# EAGLE design ADC5 (EAGLE 9.2.2)
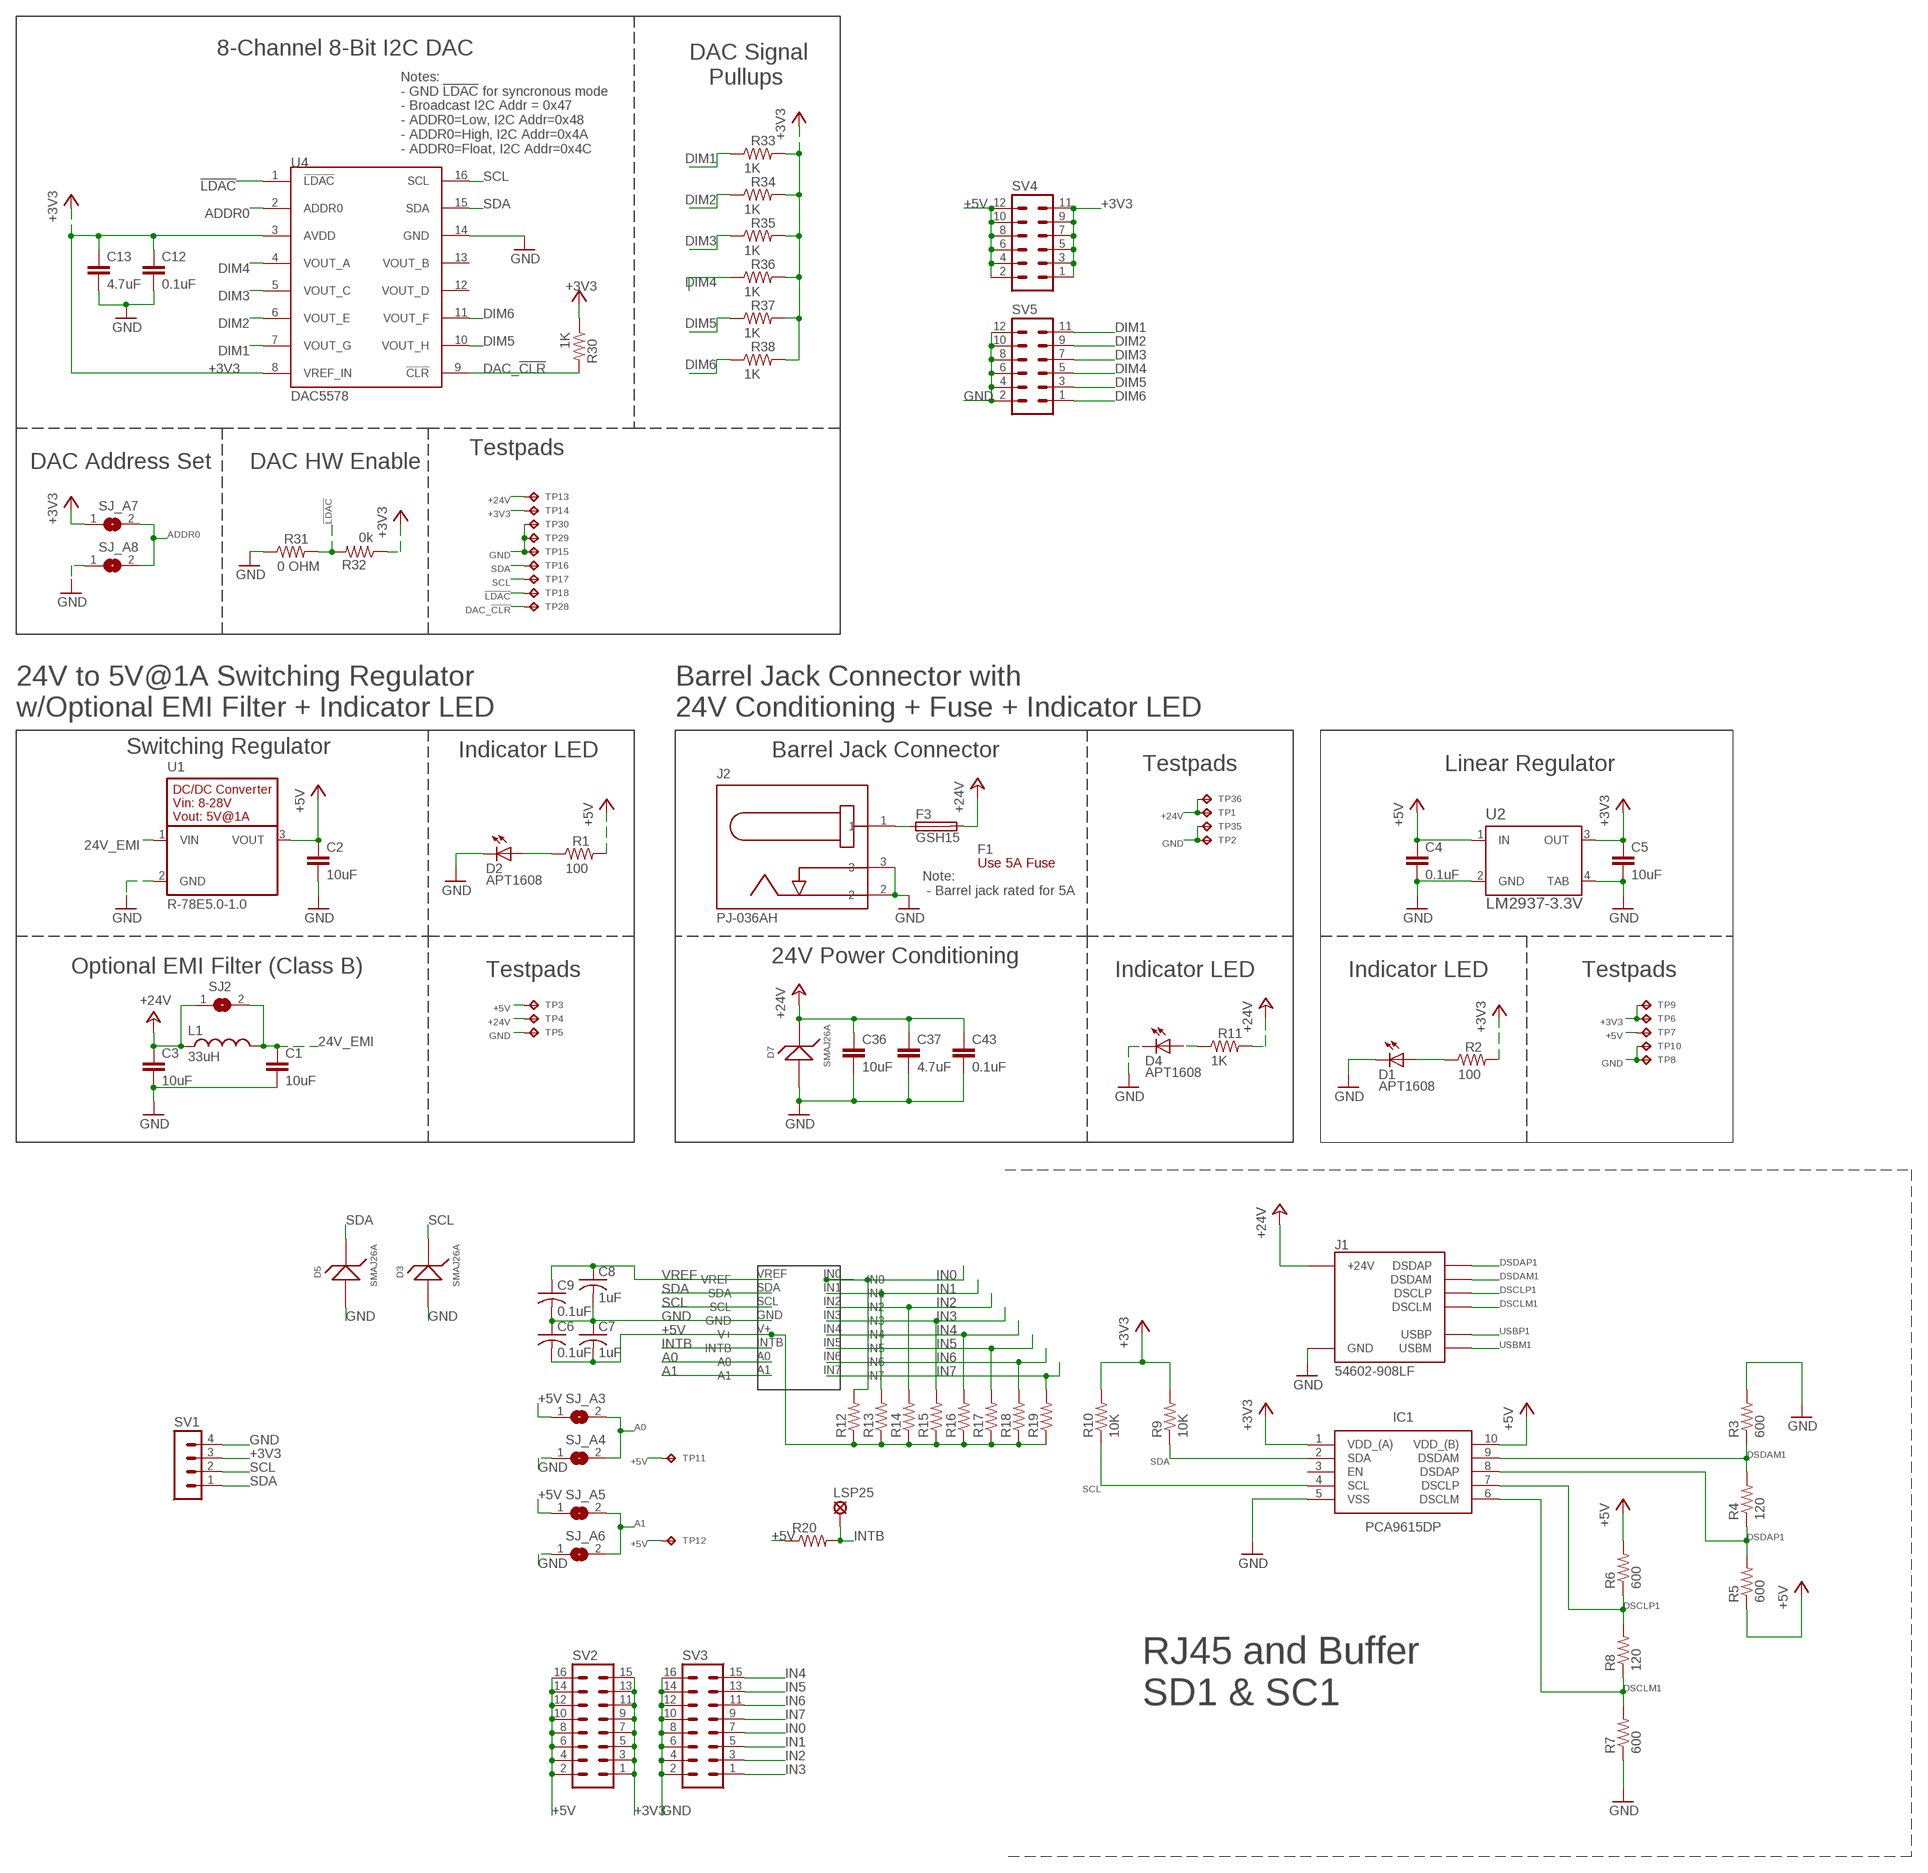
[diagram p0: schematic, sheet 1]

## Parts
C1  10uF  10UF-GMK212BBJ106KG-T  [C0805]
C2  10uF  10UF-GMK212BBJ106KG-T  [C0805]
C3  10uF  10UF-GMK212BBJ106KG-T  [C0805]
C4  0.1uF  0.1UF-C0603C104K5RACTU  [C0603]
C5  10uF  10UF-GMK212BBJ106KG-T  [C0805]
C6  0.1uF  C-USC0603  [C0603]
C7  1uF  C-USC0603  [C0603]
C8  1uF  C-USC0603  [C0603]
C9  0.1uF  C-USC0603  [C0603]
C12  0.1uF  0.1UF-C0603C104K5RACTU  [C0603]
C13  4.7uF  4.7UF-CL21A475KBQNNNE  [C0805]
C36  10uF  10UF-GMK212BBJ106KG-T  [C0805]
C37  4.7uF  4.7UF-CL21A475KBQNNNE  [C0805]
C43  0.1uF  0.1UF-C0603C104K5RACTU  [C0603]
D1  APT1608  APT1608CGCK  [CHIPLED_0603]
D2  APT1608  APT1608CGCK  [CHIPLED_0603]
D3  SMAJ26A  SMAJ26A-13-F  [SMA]
D4  APT1608  APT1608CGCK  [CHIPLED_0603]
D5  SMAJ26A  SMAJ26A-13-F  [SMA]
D7  SMAJ26A  SMAJ26A-13-F  [SMA]
F1  Use 5A Fuse  0217005.MXP  [FUSE-CARTRIDGE]
F3  GSH15  [GSH15]
IC1  PCA9615DP  [SOP50P490X110-10N]
J1  54602-908LF  OPENAG-V1-RJ45PTH  [OPENAG-V1-RJ45]
J2  PJ-036AH  BARREL-JACK-PJ-036AH-SMT-TR  [BARREL-JACK-PJ-036AH]
L1  33uH  33UH-29333C  [29333C]
LSP25  LSP10  [LSP10]
R1  100  100OHM-RC0603JR-07100RL  [RC0603N]
R2  100  100OHM-RC0603JR-07100RL  [RC0603N]
R3  600  R-US_R0603  [R0603]
R4  120  R-US_R0603  [R0603]
R5  600  R-US_R0603  [R0603]
R6  600  R-US_R0603  [R0603]
R7  600  R-US_R0603  [R0603]
R8  120  R-US_R0603  [R0603]
R9  10K  R-US_R0603  [R0603]
R10  10K  R-US_R0603  [R0603]
R11  1K  1K-ERJ-PB3D1001V  [RC0603N]
R12  R-US_R0603  [R0603]
R13  R-US_R0603  [R0603]
R14  R-US_R0603  [R0603]
R15  R-US_R0603  [R0603]
R16  R-US_R0603  [R0603]
R17  R-US_R0603  [R0603]
R18  R-US_R0603  [R0603]
R19  R-US_R0603  [R0603]
R20  R-US_R0603  [R0603]
R30  1K  1K-ERJ-PB3D1001V  [RC0603N]
R31  0 OHM  0OHM-RC0603JR-070RL  [RC0603N]
R32  0k  1K-ERJ-PB3D1001V  [RC0603N]
R33  1K  1K-ERJ-PB3D1001V  [RC0603N]
R34  1K  1K-ERJ-PB3D1001V  [RC0603N]
R35  1K  1K-ERJ-PB3D1001V  [RC0603N]
R36  1K  1K-ERJ-PB3D1001V  [RC0603N]
R37  1K  1K-ERJ-PB3D1001V  [RC0603N]
R38  1K  1K-ERJ-PB3D1001V  [RC0603N]
SJ2  EMI-BYPASS  [EMI-BYPASS]
SJ_A3  SOLDERJUMPERREFLOW_NOPASTE  [SJ1]
SJ_A4  SOLDERJUMPERREFLOW_NOPASTE  [SJ1]
SJ_A5  SOLDERJUMPERREFLOW_NOPASTE  [SJ1]
SJ_A6  SOLDERJUMPERREFLOW_NOPASTE  [SJ1]
SJ_A7  SOLDERJUMPERREFLOW_NOPASTE  [SJ1]
SJ_A8  SOLDERJUMPERREFLOW_NOPASTE  [SJ1]
SV1  MA04-1  [MA04-1]
SV2  MA08-2  [MA08-2]
SV3  MA08-2  [MA08-2]
SV4  MA06-2  [MA06-2]
SV5  MA06-2  [MA06-2]
TP1  TPTP04R  [TP04R]
TP2  TPTP04R  [TP04R]
TP3  TPTP06R  [TP06R]
TP4  TPTP06R  [TP06R]
TP5  TPTP06R  [TP06R]
TP6  TPTP04R  [TP04R]
TP7  TPTP04R  [TP04R]
TP8  TPTP04R  [TP04R]
TP9  TPTP04R  [TP04R]
TP10  TPTP04R  [TP04R]
TP11  TPTP04R  [TP04R]
TP12  TPTP04R  [TP04R]
TP13  TPTP04R  [TP04R]
TP14  TPTP04R  [TP04R]
TP15  TPTP04R  [TP04R]
TP16  TPTP04R  [TP04R]
TP17  TPTP04R  [TP04R]
TP18  TPTP04R  [TP04R]
TP28  TPTP04R  [TP04R]
TP29  TPTP04R  [TP04R]
TP30  TPTP04R  [TP04R]
TP35  TPTP04R  [TP04R]
TP36  TPTP04R  [TP04R]
U1  R-78E5.0-1.0  [R-78E5.0-1.0]
U2  LM2937-3.3V  LM2937IMP-3.3/NOPB  [MP04A]
U4  DAC5578  DAC5578SPW  [TSSOP16]
U$1  ADC128D818  [TSSOP16]

## Nets
24V_EMI: C1.1 L1.2 SJ2.2 U1.1(VIN)
24V_IN: F3.1 J2.1
!LDAC!: R31.2 R32.2 TP18.1(TP) U4.1(!LDAC!)
+3V3: C5.1 C12.1 C13.1 IC1.1(VDD_(A)) R2.2 R9.2 R10.2 R30.1 R32.1 R33.2 R34.2 R35.2 R36.2 R37.2 R38.2 SJ_A7.1 SV1.3 SV2.1 SV2.3 SV2.5 SV2.7 SV2.9 SV2.11 SV2.13 SV2.15 SV4.1 SV4.3 SV4.5 SV4.7 SV4.9 SV4.11 TP6.1(TP) TP9.1(TP) TP14.1(TP) U2.3(OUT) U4.3(AVDD) U4.8(VREF_IN)
+5V: C2.1 C4.1 C6.2 C7.2 IC1.10(VDD_(B)) R1.2 R5.1 R6.2 R12.1 R13.1 R14.1 R15.1 R16.1 R17.1 R18.1 R19.1 R20.1 SJ_A3.1 SJ_A5.1 SV2.2 SV2.4 SV2.6 SV2.8 SV2.10 SV2.12 SV2.14 SV2.16 SV4.2 SV4.4 SV4.6 SV4.8 SV4.10 SV4.12 TP3.TP TP7.1(TP) TP11.1(TP) TP12.1(TP) U1.3(VOUT) U2.1(IN) U$1.V+
+24V: C3.1 C36.1 C37.1 C43.1 D7.1 F3.2 J1.24V(6)(+24V) L1.1 R11.2 SJ2.1 TP1.1(TP) TP4.TP TP13.1(TP) TP36.1(TP)
A0: SJ_A3.2 SJ_A4.2 U$1.A0
A1: SJ_A5.2 SJ_A6.2 U$1.A1
ADDR0: SJ_A7.2 SJ_A8.2 U4.2(ADDR0)
DAC_!CLR!: R30.2 TP28.1(TP) U4.9(!CLR!)
DIM1: R33.1 SV5.11 U4.7(VOUT_G)
DIM2: R34.1 SV5.9 U4.6(VOUT_E)
DIM3: R35.1 SV5.7 U4.5(VOUT_C)
DIM4: R36.1 SV5.5 U4.4(VOUT_A)
DIM5: R37.1 SV5.3 U4.10(VOUT_H)
DIM6: R38.1 SV5.1 U4.11(VOUT_F)
DSCLM1: IC1.6(DSCLM) J1.DSCLM(5)(DSCLM) R7.2 R8.1
DSCLP1: IC1.7(DSCLP) J1.DSCLP(4)(DSCLP) R6.1 R8.2
DSDAM1: IC1.9(DSDAM) J1.DSDAM(2)(DSDAM) R3.1 R4.2
DSDAP1: IC1.8(DSDAP) J1.DSDAP(1)(DSDAP) R4.1 R5.2
GND: C1.2 C2.2 C3.2 C4.2 C5.2 C6.1 C7.1 C8.2 C9.2 C12.2 C13.2 C36.2 C37.2 C43.2 D1.C D2.C D3.2 D4.C D5.2 D7.2 IC1.5(VSS) J1.GND(3)(GND) J2.2 J2.3 R3.2 R7.1 R31.1 SJ_A4.1 SJ_A6.1 SJ_A8.1 SV1.4 SV3.2 SV3.4 SV3.6 SV3.8 SV3.10 SV3.12 SV3.14 SV3.16 SV5.2 SV5.4 SV5.6 SV5.8 SV5.10 SV5.12 TP2.1(TP) TP5.TP TP8.1(TP) TP10.1(TP) TP15.1(TP) TP29.1(TP) TP30.1(TP) TP35.1(TP) U1.2(GND) U2.2(GND) U2.4(TAB) U4.14(GND) U$1.GND
IN0: R12.2 SV3.7 U$1.IN0
IN1: R13.2 SV3.5 U$1.IN1
IN2: R14.2 SV3.3 U$1.IN2
IN3: R15.2 SV3.1 U$1.IN3
IN4: R16.2 SV3.15 U$1.IN4
IN5: R17.2 SV3.13 U$1.IN5
IN6: R18.2 SV3.11 U$1.IN6
IN7: R19.2 SV3.9 U$1.IN7
INTB: LSP25.MP R20.2 U$1.INTB
N$1: D1.A R2.1
N$2: D2.A R1.1
N$4: D4.A R11.1
SCL: D3.1 IC1.4(SCL) R10.1 SV1.2 TP17.1(TP) U4.16(SCL) U$1.SCL
SDA: D5.1 IC1.2(SDA) R9.1 SV1.1 TP16.1(TP) U4.15(SDA) U$1.SDA
USBM1: J1.USBM(8)(USBM)
USBP1: J1.USBP(7)(USBP)
VREF: C8.1 C9.1 U$1.VREF
Unconnected: IC1.3(EN) U4.12(VOUT_D) U4.13(VOUT_B)

## Notes on the sheet
- 8-Channel 8-Bit I2C DAC
- DAC Signal 
     Pullups
- Notes:
  - GND !LDAC! for syncronous mode
  - Broadcast I2C Addr = 0x47
  - ADDR0=Low, I2C Addr=0x48
  - ADDR0=High, I2C Addr=0x4A
  - ADDR0=Float, I2C Addr=0x4C
- Testpads
- DAC Address Set | DAC HW Enable
- 24V to 5V@1A Switching Regulator
  w/Optional EMI Filter + Indicator LED
- Barrel Jack Connector with
  24V Conditioning + Fuse + Indicator LED
- Switching Regulator | Indicator LED | Barrel Jack Connector
- Testpads | Linear Regulator
- Note:
   - Barrel jack rated for 5A
- 24V Power Conditioning
- Optional EMI Filter (Class B) | Testpads | Indicator LED | Indicator LED | Testpads
- RJ45 and Buffer
  SD1 & SC1

## Library data of the parts
C1-C3 C5 C36 = openag-capacitors:10UF-GMK212BBJ106KG-T: CAP CER 10UF 35V X5R 0805 Description: 10µF ±10% 35V Ceramic Capacitor X5R 0805 (2012 Metric) Technical Specifications: Capacitance: 10µF Tolerance: ±10% Rated Voltage: 35V Temperature Coefficient: X5R Operating Temperature: -55°C ~ 85°C Package / Case: 0805 (2012 Metric) Datasheet(s): GMK212BBJ106KG-T Spec <http://ds.yuden.co.jp/TYCOMPAS/ut/detail.do?productNo=GMK212BBJ106KG-T&fileName=GMK212BBJ106KG-T_SS&mode=specSheetDownload> Vendor(s): Digikey: 587-4893-1-ND <https://www.digikey.com/product-detail/en/taiyo-yuden/GMK212BBJ106KG-T/587-4893-1-ND/6563736>; MANUFACTURER: Taiyo Yuden; MPN: GMK212BBJ106KG-T; VENDOR: Digikey; VLINK: https://www.digikey.com/product-detail/en/taiyo-yuden/GMK212BBJ106KG-T/587-4893-1-ND/6563736; VPN: 587-4893-1-ND
C4 C12 C43 = openag-capacitors:0.1UF-C0603C104K5RACTU: CAP CER 0.1UF 50V X7R 0603 Description: 0.1µF ±10% 50V Ceramic Capacitor X7R 0603 (1608 Metric) Technical Specifications: Capacitance: 0.1µF Tolerance: ±10% Rated Voltage: 50V Temperature Coefficient: X7R Operating Temperature: -55°C ~ 125°C Package / Case: 0603 (1608 Metric) Datasheet(s): X7R Dielectric, 6.3-250 VDC <https://search.kemet.com/component-edge/download/datasheet/C0603C104K5RACTU.pdf> Vendor(s): Digikey: 399-5089-1-ND <https://www.digikey.com/product-detail/en/kemet/C0603C104K5RACTU/399-5089-1-ND/1465623>; MANUFACTURER: Kemet; MPN: C0603C104K5RACTU; VENDOR: Digikey; VLINK: https://www.digikey.com/product-detail/en/kemet/C0603C104K5RACTU/399-5089-1-ND/1465623; VPN: 399-5089-1-ND
C6-C9 = rcl:C-US: CAPACITOR, American symbol; SPICEPREFIX: C
C13 C37 = openag-capacitors:4.7UF-CL21A475KBQNNNE: CAP CER 4.7UF 50V X5R 0805 Description: 4.7µF ±10% 50V Ceramic Capacitor X5R 0805 (2012 Metric) Technical Specifications: Capacitance: 4.7uF Tolerance: ±10% Rated Voltage: 50V Temperature Coefficient: X5R Operating Temperature: -55°C ~ 85°C Package/Case: 0805 (2012 Metric) Datasheet(s): CL21A475KBQNNNE Characteristics <http://www.samsungsem.com/kr/front/downloadcms.do?path=/kr/support/product-search/mlcc/__icsFiles/afieldfile/2014/11/05&fileName=C_CL21A475KBQNNNE.pdf> Vendor(s): Digikey: 1276-1248-1-ND <https://www.digikey.com/product-detail/en/samsung-electro-mechanics/CL21A475KBQNNNE/1276-1248-1-ND/3889334>; MANUFACTURER: Samsung; MPN: CL21A475KBQNNNE; VENDOR: Digikey; VLINK: https://www.digikey.com/product-detail/en/samsung-electro-mechanics/CL21A475KBQNNNE/1276-1248-1-ND/3889334; VPN: 1276-1248-1-ND
D1 D2 D4 = openag-diodes:APT1608CGCK: LED GREEN CLEAR 0603 SMD Description: Green 570nm LED Indication - Discrete 2.1V 0603 (1608 Metric) Technical Specifications: Color: Green Lens Color: Colorless Lens Transparency: Clear Millicandela Rating: 50mcd Lens Style/Size: Rectangle with Flat Top, 1.20mm x 0.80mm Voltage - Forward (Vf) (Typ): 2.1V Current - Test: 20mA Viewing Angle: 120° Mounting Type: Surface Mount Wavelength - Dominant: 570nm Wavelength - Peak: 574nm Package / Case: 0603 (1608 Metric) Supplier Device Package: Chip LED Size / Dimension: 1.60mm L x 0.80mm W Height (Max): 0.75mm Datasheet(s): APT1608CGCK <http://www.kingbrightusa.com/images/catalog/SPEC/APT1608CGCK.pdf> Vendor(s): Digikey: 754-1116-1-ND <https://www.digikey.com/product-detail/en/kingbright/APT1608CGCK/754-1116-1-ND/1747833#>; MANUFACTURER: Kingbright; MPN: APT1608CGCK; VENDOR: Digikey; VLINK: https://www.digikey.com/product-detail/en/kingbright/APT1608CGCK/754-1116-1-ND/1747833#; VPN: 754-1116-1-ND
D3 D5 D7 = openag-diodes:SMAJ26A-13-F: TVS DIODE 26VWM 42.1VC SMA Description: TVS DIODE 26VWM 42.1VC SMA Technical Specifications: Type: Zener Voltage - Reverse Standoff (Typ): 26V Voltage - Breakdown (Min): 28.9V Voltage - Clamping (Max) @ Ipp: 42.1V Current - Peak Pulse (10/1000µs): 9.5A Power - Peak Pulse: 400W Power Line Protection: No Operating Temperature: -55°C ~ 150°C (TJ) DO-214AC, SMA Datasheet(s): SMAJ5.0(C)A - SMAJ200(C)A Vendor(s): Digikey: SMAJ26A-FDICT-ND <https://www.digikey.com/product-detail/en/diodes-incorporated/SMAJ26A-13-F/SMAJ26A-FDICT-ND/806583>; MANUFACTURER: Diodes Incorporated; MPN: SMAJ26A-13-F; VENDOR: Digikey; VLINK: https://www.digikey.com/product-detail/en/diodes-incorporated/SMAJ26A-13-F/SMAJ26A-FDICT-ND/806583; VPN: SMAJ26A-FDICT-ND
F1 = openag-fuses:0217005.MXP: FUSE GLASS 5A 250VAC 5X20MM Description: FUSE GLASS 5A 250VAC 5X20MM Technical Specifications: Fuse Type: Cartridge, Glass Current Rating: 5A Voltage Rating - AC: 250V Response Time: Fast Package / Case: 5mm x 20mm Mounting Type: Holder Breaking Capacity @ Rated Voltage: 50A Melting I²t: 42.795 Approvals: BSI, CE, CCC, CSA, KC, PSE, SEMKO, UR, VDE Operating Temperature: -55°C ~ 125°C Size / Dimension: 0.205" Dia x 0.787" L (5.20mm x 20.00mm) DC Cold Resistance: 0.0137 Ohms Datasheet(s): 217 Series Datasheet <http://www.littelfuse.com/~/media/electronics/datasheets/fuses/littelfuse_fuse_217_datasheet.pdf.pdf> Vendor(s): Digikey: F1725-ND <https://www.digikey.com/product-detail/en/littelfuse-inc/0217005.MXP/F1725-ND/777549#>; MANUFACTURER: Littelfuse Inc.; MPN: 0217005.MXP; VENDOR: Digikey; VLINK: https://www.digikey.com/product-detail/en/littelfuse-inc/0217005.MXP/F1725-ND/777549; VPN: F1725-ND
F3 = openag-fuses:GSH15: FUSE BLOCK CART 250V 6.3A PCB Description: Fuse Block 6.3A 250V 1 Circuit Cartridge PCB Technical Specifications: Fuseholder Type: Block Fuse Type: Cartridge For Use With/Related Products: 5mm x 20mm Fuse Size: 5mm x 20mm Number of Circuits: 1 Voltage: 250V Current Rating: 6.3A Mounting Type: PCB Orientation: Horizontal Termination Style: PC Pin Contact Material: Copper Alloy Contact Finish: Tin Datasheet(s): 649 Series <http://www.littelfuse.com/~/media/electronics/datasheets/fuse_blocks/littelfuse_fuse_block_649_datasheet.pdf.pdf> Vendor(s): Digikey: WK0011-ND <https://www.digikey.com/product-detail/en/littelfuse-inc/64900001039/WK0011-ND/245470>; MANUFACTURER: Littelfuse Inc.; MPN: 64900001039; VENDOR: Digikey; VLINK: https://www.digikey.com/product-detail/en/littelfuse-inc/64900001039/WK0011-ND/245470; VPN: WK0011-ND
IC1 = PCA9615DP:PCA9615DP: Buffer, ReDriver 2 Channel 400kHz 10-TSSOP Source: Datasheet <http://www.nxp.com/docs/en/data-sheet/PCA9615.pdf>; DESCRIPTION: Buffer, ReDriver 2 Channel 400kHz 10-TSSOP; HEIGHT: 1.1mm; MANUFACTURER_NAME: Nexperia; MANUFACTURER_PART_NUMBER: PCA9615DP; SUPPLIER_NAME: RS
J1 = openag_connector:OPENAG-V1-RJ45: Amphenol FCI - 54602-908LF - CONN MOD JACK 8P8C R/A UNSHLD Description: Jack Modular Connector 8p8c (RJ45, Ethernet) 90� Angle (Right) Unshielded Cat3 Technical Specifications: Connector Type: Jack Number of Positions/Contacts: 8p8c (RJ45, Ethernet) Number of Ports: 1 Number of Rows: 1 Mounting Type: Through Hole Orientation: 90� Angle (Right) Termination: Solder Shielding: Unshielded Ratings: Cat3 Features: Board Lock LED Color: Does Not Contain LED Tab Direction: Down Contact Material: Copper Alloy Contact Finish: Gold Contact Finish Thickness: 15�in (0.38�m) Housing Material: Polyester, Glass Filled Operating Temperature: -40�C ~ 70�C Datasheet(s): 54601-x04(zzz)WPLF Drawing <http://cdn.amphenol-icc.com/media/wysiwyg/files/drawing/c-bmj-0102.pdf> Vendor(s): Digikey: 609-1046-ND <https://www.digikey.com/product-detail/en/amphenol-fci/54602-908LF/609-1046-ND/1001360>; POPULATE: YES; VERIFIED: NO
J2 = openag-connectors:BARREL-JACK-PJ-036AH-SMT-TR: CONN PWR JACK 2X5.5MM SOLDER Description: Power Barrel Connector Jack 2.10mm ID (0.083"), 5.50mm OD (0.217") Surface Mount, Right Angle Technical Specifications: Connector Type: Jack Gender: Male Industry Recognized Mating Diameter: 2.10mm ID (0.083"), 5.50mm OD (0.217") Actual Diameter: 0.078" (2.00mm ID), 0.248" (6.30mm OD) Number of Positions/Contacts: 2 Conductors, 3 Contacts Internal Switch(s): Single Switch, Normally Closed Mounting Type: Surface Mount, Right Angle Termination: Solder Shielding: Unshielded Voltage - Rated: 24VDC Current Rating: 5A Mating Length/Depth: 0.360" (9.15mm) Contact Material - Plating: Silver Operating Temperature: -25°C ~ 85°C Housing Material: Polyamide (PA6T), Nylon 6T Contact Material: Brass; Copper Alloy Body Color: Black Datasheet(s): PJ-036AH-SMT-TR <http://www.cui.com/product/resource/digikeypdf/pj-036ah-smt-tr.pdf> Vendor(s): Digikey: CP-036AHPJCT-ND <https://www.digikey.com/product-detail/en/cui-inc/PJ-036AH-SMT-TR/CP-036AHPJCT-ND/1530994>; MANUFACTURER: CUI Inc.; MPN: PJ-036AH-SMT-TR; VENDOR: Digikey; VLINK: https://www.digikey.com/product-detail/en/cui-inc/PJ-036AH-SMT-TR/CP-036AHPJCT-ND/1530994; VPN: CP-036AHPJCT-ND
L1 = openag-inductors:33UH-29333C: FIXED IND 33UH 1A 120 MOHM SMD Description: 33µH Shielded Wirewound Inductor 1A 120 mOhm Max Nonstandard Technical Specifications: Type: Wirewound Inductance: 33µH Current Rating: 1A Shielding: Shielded DC Resistance (DCR): 120 mOhm Max Operating Temperature: -40°C ~ 85°C Frequency - Test: 10kHz Mounting Type: Surface Mount Package / Case: Nonstandard Size / Dimension: 0.283" L x 0.283" W (7.20mm x 7.20mm) Height - Seated (Max): 0.157" (4.00mm) Datasheet(s): 2900 Series <https://www.murata-ps.com/data/magnetics/kmp_2900.pdf> Vendor(s): Digikey: 811-1138-1-ND <https://www.digikey.com/product-detail/en/murata-power-solutions-inc/29333C/811-1138-1-ND/1924860>; MANUFACTURER: Murata Power Solutions Inc.; MPN: 29333C; VENDOR: Digikey; VLINK: https://www.digikey.com/product-detail/en/murata-power-solutions-inc/29333C/811-1138-1-ND/1924860; VPN: 811-1138-1-ND
LSP25 = solpad:LSP10: SOLDER PAD drill 1.0 mm, distributor Buerklin, 12H555
R1 R2 = openag-resistors:100OHM-RC0603JR-07100RL: RES SMD 100 OHM 5% 1/10W 0603 Description: 100 Ohms ±5% 0.1W, 1/10W Chip Resistor 0603 (1608 Metric) Moisture Resistant Thick Film Technical Specifications: Resistance: 100 Ohms Tolerance: ±5% Power (Watts): 0.1W, 1/10W Composition: Thick Film Features: Moisture Resistant Temperature Coefficient: ±100ppm/°C Operating Temperature: -55°C ~ 155°C Package / Case: 0603 (1608 Metric) Supplier Device Package: 0603 Size / Dimension: 0.063" L x 0.032" W (1.60mm x 0.80mm) Height - Seated (Max): 0.022" (0.55mm) Number of Terminations: 2 Datasheet(s): Thick Film Chip Resistor Intro <http://www.yageo.com.tw/exep/pages/download/literatures/PYu-R_INT-thick_7.pdf> Chip Resistor Marking <http://www.yageo.com/exep/pages/download/literatures/PYu-R_Marking_2.pdf> RC Series, L Datasheet <http://www.yageo.com/documents/recent/PYu-RC_Group_51_RoHS_L_8.pdf> Vendor(s): Digikey: 311-100GRCT-ND <https://www.digikey.com/product-detail/en/yageo/RC0603JR-07100RL/311-100GRCT-ND/729644>; MANUFACTURER: Yageo; MPN: RC0603JR-07100RL; VENDOR: Digikey; VLINK: https://www.digikey.com/product-detail/en/yageo/RC0603JR-07100RL/311-100GRCT-ND/729644; VPN: 311-100GRCT-ND
R3-R10 R12-R19 = rcl:R-US_: RESISTOR, American symbol; SPICEPREFIX: R
R11 R30 R33-R38 = openag-resistors:1K-ERJ-PB3D1001V: RES SMD 1K OHM 0.5% 1/5W 0603 Description: 1 kOhms ±0.5% 0.2W, 1/5W Chip Resistor 0603 (1608 Metric) Automotive AEC-Q200, Pulse Withstanding Thick Film Technical Specifications: Resistance: 1 kOhms Tolerance: ±0.5% Power: 0.2W, 1/5W Operating Temperature: -55°C ~ 155°C Package / Case: 0603 (1608 Metric) Datasheet(s): ERJ-PB3, PB6 Series, High Precision Datasheet <https://industrial.panasonic.com/cdbs/www-data/pdf/RDM0000/AOA0000C328.pdf> Vendor(s): Digikey: P20283CT-ND <https://www.digikey.com/product-detail/en/panasonic-electronic-components/ERJ-PB3D1001V/P20283CT-ND/6214538>; MANUFACTURER: Panasonic; MPN: P20283CT-ND; VENDOR: Digikey; VLINK: https://www.digikey.com/product-detail/en/panasonic-electronic-components/ERJ-PB3D1001V/P20283CT-ND/6214538; VPN: P20283CT-ND
R20 = resistor:R-US_: RESISTOR, American symbol
R31 = openag-resistors:0OHM-RC0603JR-070RL: RES SMD 0 OHM JUMPER 1/10W 0603 Description: 0 Ohms Jumper 0.1W, 1/10W Chip Resistor 0603 (1608 Metric) Moisture Resistant Thick Film Technical Specifications: Resistance: 0 Ohms Power: 0.1W, 1/10W Operating Temperature: -55°C ~ 155°C Package / Case: 0603 (1608 Metric) Datasheet(s): RC Series, L Datasheet <http://www.yageo.com/documents/recent/PYu-RC_Group_51_RoHS_L_8.pdf> Vendor(s): Digikey: 311-0.0GRCT-ND <https://www.digikey.com/product-detail/en/yageo/RC0603JR-070RL/311-0.0GRCT-ND/729622>; MANUFACTURER: Yageo; MPN: RC0603JR-070RL; VENDOR: Digikey; VLINK: https://www.digikey.com/product-detail/en/yageo/RC0603JR-070RL/311-0.0GRCT-ND/729622; VPN: 311-0.0GRCT-ND
R32 = openag-resistors:1K-ERJ-PB3D1001V: RES SMD 1K OHM 0.5% 1/5W 0603 Description: 1 kOhms ±0.5% 0.2W, 1/5W Chip Resistor 0603 (1608 Metric) Automotive AEC-Q200, Pulse Withstanding Thick Film Technical Specifications: Resistance: 1 kOhms Tolerance: ±0.5% Power: 0.2W, 1/5W Operating Temperature: -55°C ~ 155°C Package / Case: 0603 (1608 Metric) Datasheet(s): ERJ-PB3, PB6 Series, High Precision Datasheet <https://industrial.panasonic.com/cdbs/www-data/pdf/RDM0000/AOA0000C328.pdf> Vendor(s): Digikey: P20283CT-ND <https://www.digikey.com/product-detail/en/panasonic-electronic-components/ERJ-PB3D1001V/P20283CT-ND/6214538>; MANUFACTURER: Panasonic; MPN: P20283CT-ND; VALUE: 1K; VENDOR: Digikey; VLINK: https://www.digikey.com/product-detail/en/panasonic-electronic-components/ERJ-PB3D1001V/P20283CT-ND/6214538; VPN: P20283CT-ND
SJ2 = openag-connectors:EMI-BYPASS: EMI Bypass Solder Jumper; MPN: N/A
SJ_A3-SJ_A8 = openag-connectors:SOLDERJUMPER: SMD Solder JUMPER Solder the two pads together to create a connection, or remove the solder to break it. REFLOW - Use this footprint for solder paste and reflow ovens. WAVE - Use this footprint for hand-soldering (larger pads). CLOSED - Has a trace between the two pads to ensure it is closed by default. The trace needs to be cut to disable the jumper, and can be closed again by creating a solder bridge between the two pads.; MPN: N/A
SV1 = con-lstb:MA04-1: PIN HEADER; OC_FARNELL: unknown; OC_NEWARK: unknown
SV2 SV3 = con-lstb:MA08-2: PIN HEADER; OC_FARNELL: unknown; OC_NEWARK: unknown
SV4 SV5 = con-lstb:MA06-2: PIN HEADER; OC_FARNELL: unknown; OC_NEWARK: unknown
TP1-TP18 TP28-TP30 TP35 TP36 = openag-testpads:TP: Test pad; MPN: N/A
U1 = openag-regulators:R-78E5.0-1.0: DC/DC CONVERTER 5V 5W Description: Linear Regulator Replacement DC DC Converter 1 Output 5V 1A 8V - 28V Input Technical Specifications: Type: Linear Regulator Replacement Number of Outputs: 1 Voltage - Input (Min): 8V Voltage - Input (Max): 28V Voltage - Output 1: 5V Current - Output (Max): 1A Power (Watts): 5W Applications: ITE (Commercial) Features: SCP Operating Temperature: -40°C ~ 85°C Efficiency: 91% Mounting Type: Through Hole Package / Case: 3-SIP Module Size / Dimension: 0.46" L x 0.33" W x 0.41" H (11.6mm x 8.5mm x 10.4mm) Datasheet(s): R-78E-1.0 Series Datasheet <https://www.recom-power.com/pdf/Innoline/R-78Exx-1.0.pdf> Vendor(s): Digikey: 945-2201-ND <https://www.digikey.com/product-detail/en/recom-power/R-78E5.0-1.0/945-2201-ND/4930585>; MANUFACTURER: Recom Power; MPN: R-78E5.0-1.0; VENDOR: Digikey; VLINK: https://www.digikey.com/product-detail/en/recom-power/R-78E5.0-1.0/945-2201-ND/4930585; VPN: 945-2201-ND
U2 = openag-regulators:LM2937IMP-3.3/NOPB: IC REG LIN 3.3V 400MA SOT223-4 Description: Linear Voltage Regulator IC Positive Fixed 1 Output 3.3V 400mA SOT-223-4 Technical Specifications: Output Configuration: Positive Output Type: Fixed Number of Regulators: 1 Voltage - Input (Max): 26V Voltage - Output (Min/Fixed): 3.3V Voltage Dropout (Max): 1V @ 50mA Current - Output: 400mA Current - Quiescent (Iq): 2mA Current - Supply (Max): 1.25A Protection Features: Over Temperature, Reverse Polarity, Short Circuit Operating Temperature: -40°C ~ 85°C Mounting Type: Surface Mount Package / Case: TO-261-4, TO-261AA Supplier Device Package: SOT-223-4 Base Part Number: LM2937 Datasheet(s): LM2937-2.5, LM2937-3.3 Datasheet <http://www.ti.com/lit/ds/symlink/lm2937-2.5.pdf> Vendor(s): Digikey: LM2937IMP-3.3/NOPBCT-ND <https://www.digikey.com/product-detail/en/texas-instruments/LM2937IMP-3.3-NOPB/LM2937IMP-3.3-NOPBCT-ND/270742#>; MANUFACTURER: Texas Instruments; MPN: LM2937IMP-3.3/NOPB; VENDOR: Digikey; VLINK: https://www.digikey.com/product-detail/en/texas-instruments/LM2937IMP-3.3-NOPB/LM2937IMP-3.3-NOPBCT-ND/270742#; VPN: LM2937IMP-3.3/NOPBCT-ND
U4 = openag-dacs:DAC5578SPW: IC DAC 8BIT I2C OCTAL 16TSSOP Description: 8 Bit Digital to Analog Converter 8 16-TSSOP Technical Specifications: Number of Bits: 8 Number of D/A Converters: 8 Settling Time: 12µs (Typ) Output Type: Voltage - Buffered Differential Output: No Data Interface: I²C Reference Type: External Voltage - Supply, Analog: 2.7 V ~ 5.5 V Voltage - Supply, Digital: 2.7 V ~ 5.5 V INL/DNL (LSB): ±0.01, ±0.01 Architecture: String DAC Operating Temperature: -40°C ~ 125°C Package / Case: 16-TSSOP (0.173", 4.40mm Width) Supplier Device Package: 16-TSSOP Base Part Number: DAC5578 Datasheet(s): DAC5578,6578,7578 <http://www.ti.com/lit/ds/symlink/dac5578.pdf> Analog Signal Chain Guide <http://www.ti.com/lit/pdf/slyb174> Vendor(s): Digikey: 296-27736-5-ND <https://www.digikey.com/product-detail/en/texas-instruments/DAC5578SPW/296-27736-5-ND/2360827>; MANUFACTURER: Texas Instruments; MPN: DAC5578SPW; VENDOR: Digikey; VLINK: https://www.digikey.com/product-detail/en/texas-instruments/DAC5578SPW/296-27736-5-ND/2360827; VPN: 296-27736-5-ND
U$1 = untitled:ADC128D818

## Net classes
0 default: width 0.305 mm, drill 0.254 mm, clearance 0.254 mm

## Board
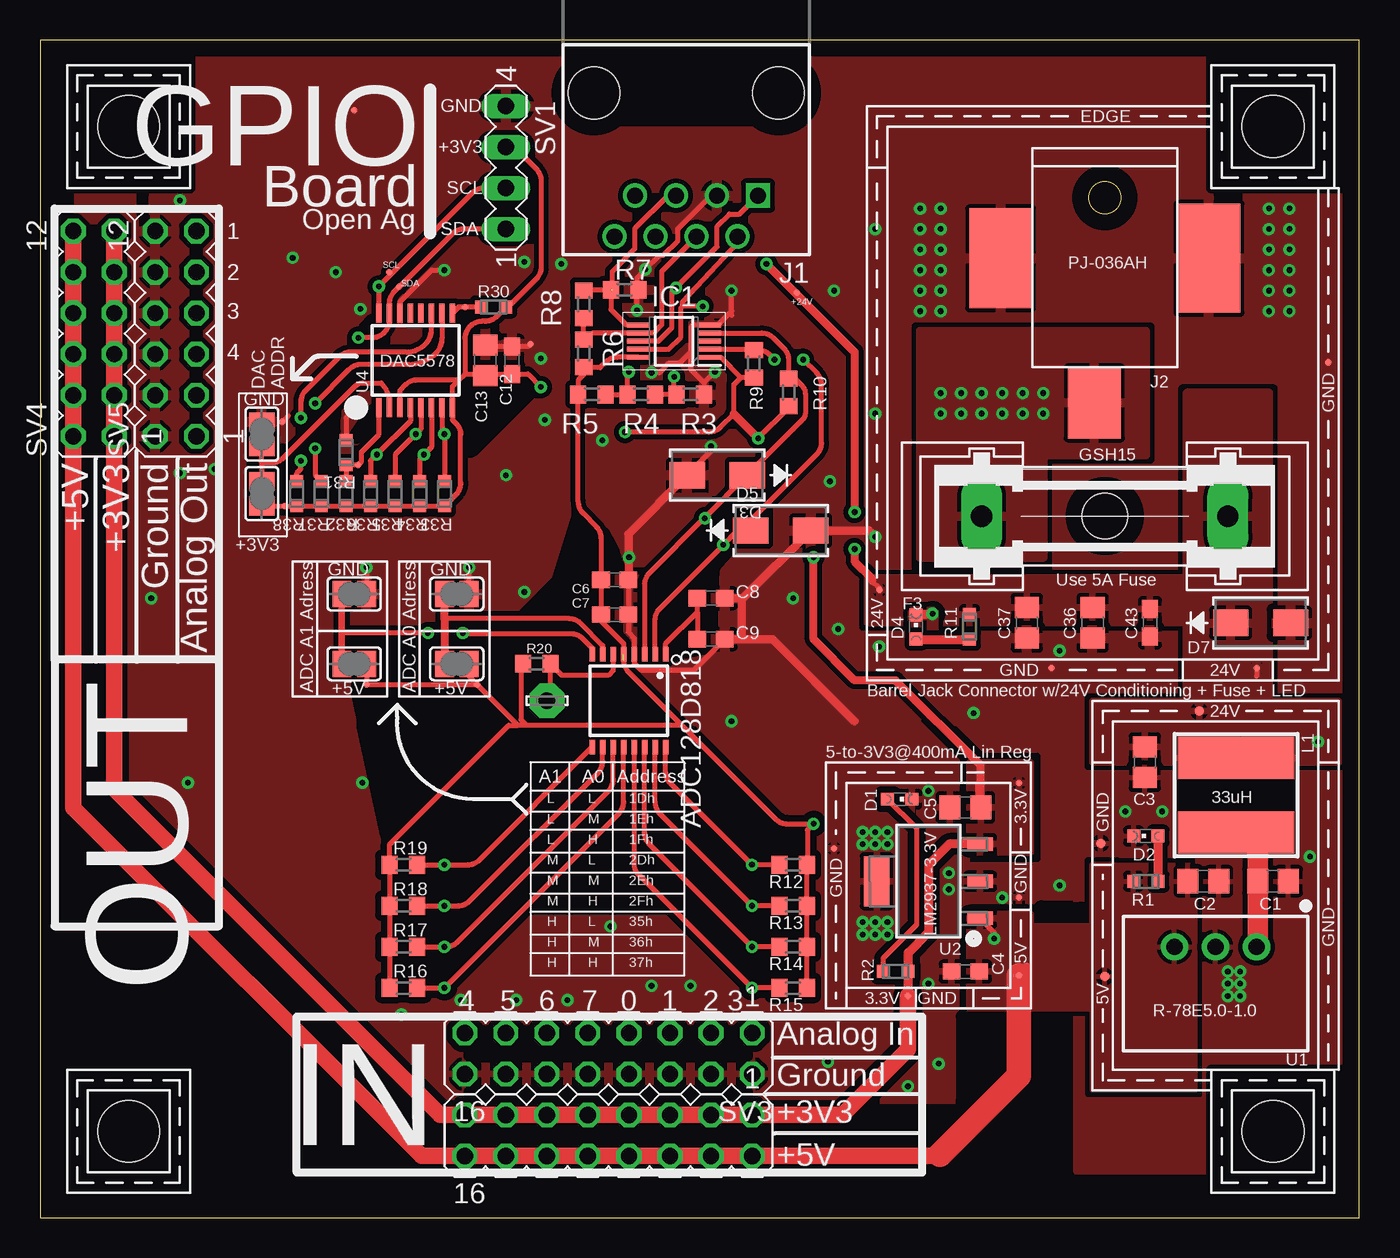
[diagram p1: board, top side]
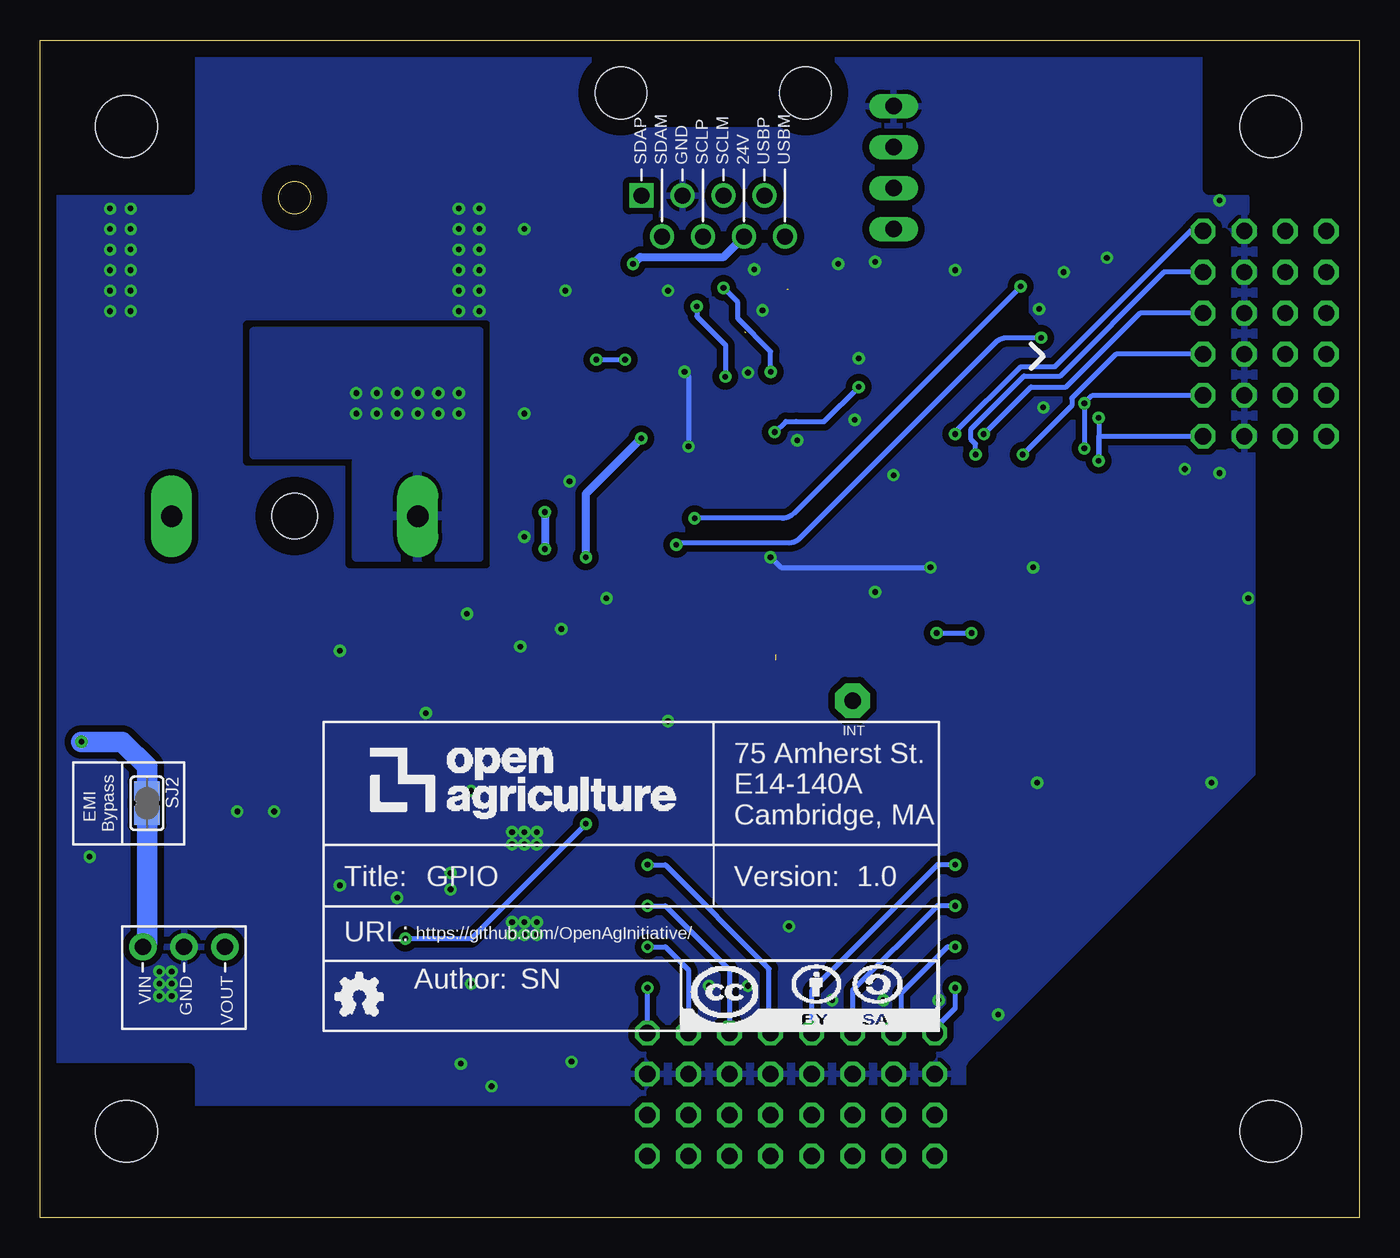
[diagram p2: board, bottom side, seen from below]

Size 81.66 x 72.9 mm. Coordinates in mm from the lower left corner, seen from the top.
Outline: 0,72.9 0,0 81.66,0 81.66,72.9 0,72.9
Copper layers (1*16): Top 0.035mm / dielectric 1.5mm / Bottom 0.035mm
Design rules "default *": minimum track width 6mil, minimum drill 0.35mm, track to track 6mil, track to pad 6mil, pad to pad 6mil, via to via 6mil, smd to smd 6mil, copper to edge 40mil, drill to drill 6mil, minimum pad ring 10mil, minimum via ring 8mil, stop-mask expansion 4mil, vias tented up to drill 14mil, thermal gap 10mil
tRestrict: 26 lines
bRestrict: 11 lines

### Footprints (pad centres in the part's own frame; a part is rotated, then mirrored left to right if it is on the bottom)
C0805 = smd 1.3 x 1.5: 1 -0.95,0; 2 0.95,0
C0603 = smd 1.1 x 1: 1 -0.85,0; 2 0.85,0
CHIPLED_0603 = smd 0.8 x 0.8: A 0,-0.75; C 0,0.75
SMA = smd 2.18 x 1.63: 1 -1.857,0; 2 1.857,0
GSH15 = drill 1.321 pad 2.54 long: 1 -7.62,0; 2 7.62,0 | hole 2.794: 0,0
SOP50P490X110-10N = smd 1.4 x 0.3: 1 -2.2,1; 2 -2.2,0.5; 3 -2.2,0; 4 -2.2,-0.5; 5 -2.2,-1; 6 2.2,-1; 7 2.2,-0.5; 8 2.2,0; 9 2.2,0.5; 10 2.2,1
OPENAG-V1-RJ45 = drill 1: 24V(6) 1.905,8.89; DSCLM(5) 0.635,6.35; DSCLP(4) -0.635,8.89; DSDAM(2) -3.175,8.89; GND(3) -1.905,6.35; USBM(8) 4.445,8.89; USBP(7) 3.175,6.35 | drill 1 square: DSDAP(1) -4.445,6.35 | hole 3.2: -5.715,0; 5.715,0
BARREL-JACK-PJ-036AH = smd 4.4 x 3.3: 1 2.2,-0.65 | smd 6.75 x 3.9: 2 -6.75,6.45 | smd 6.2 x 3.9: 3 -6.75,-6.45
29333C = smd 2.6 x 7.2: 1 -2.3,0; 2 2.3,0
LSP10 = drill 1.016 pad 2.159 octagon: MP 0,0
RC0603N = smd 0.756 x 0.8: 1 -0.778,0; 2 0.778,0
R0603 = smd 1 x 1.1: 1 -0.85,0; 2 0.85,0
EMI-BYPASS = smd 1.168 x 1.6: 1 -0.762,0.254; 2 0.762,0.254
SJ1 = smd 1.168 x 1.6: 1 -0.762,0; 2 0.762,0
MA04-1 = drill 1.016 long: 1 -3.81,0; 2 -1.27,0; 3 1.27,0; 4 3.81,0
MA08-2 = drill 1.016 octagon: 1 -8.89,-1.27; 2 -8.89,1.27; 3 -6.35,-1.27; 4 -6.35,1.27; 5 -3.81,-1.27; 6 -3.81,1.27; 7 -1.27,-1.27; 8 -1.27,1.27; 9 1.27,-1.27; 10 1.27,1.27; 11 3.81,-1.27; 12 3.81,1.27; 13 6.35,-1.27; 14 6.35,1.27; 15 8.89,-1.27; 16 8.89,1.27
MA06-2 = drill 1.016 octagon: 1 -6.35,-1.27; 2 -6.35,1.27; 3 -3.81,-1.27; 4 -3.81,1.27; 5 -1.27,-1.27; 6 -1.27,1.27; 7 1.27,-1.27; 8 1.27,1.27; 9 3.81,-1.27; 10 3.81,1.27; 11 6.35,-1.27; 12 6.35,1.27
TP04R = smd 0.4 x 0.4: 1 0,0
TP06R = smd 0.6 x 0.6: TP 0,0
R-78E5.0-1.0 = drill 1 pad 1.676: 1 -2.54,0; 2 0,0; 3 2.54,0
MP04A = smd 1.6 x 0.838: 1 -3.2,2.3; 2 -3.2,0; 3 -3.2,-2.3 | smd 1.6 x 3.099: 4 3.2,0
TSSOP16 = smd 0.35 x 1.2: 1 -2.275,-2.925; 2 -1.625,-2.925; 3 -0.975,-2.925; 4 -0.325,-2.925; 5 0.325,-2.925; 6 0.975,-2.925; 7 1.625,-2.925; 8 2.275,-2.925; 9 2.275,2.925; 10 1.625,2.925; 11 0.975,2.925; 12 0.325,2.925; 13 -0.325,2.925; 14 -0.975,2.925; 15 -1.625,2.925; 16 -2.275,2.925
TSSOP16' = smd 0.9 x 0.35: A0 -2.875,-1.625; A1 -2.875,-2.275; GND -2.875,0.325; IN0 2.875,2.275; IN1 2.875,1.625; IN2 2.875,0.975; IN3 2.875,0.325; IN4 2.875,-0.325; IN5 2.875,-0.975; IN6 2.875,-1.625; IN7 2.875,-2.275; INTB -2.875,-0.975; SCL -2.875,0.975; SDA -2.875,1.625; V+ -2.875,-0.325; VREF -2.875,2.275
CORNER = hole 3.81: 0,0

### Placement (x,y rotation side)
ATTRIBUTES  [DOCFIELD]  64.12,11.57 0 bottom
C1  76.33,20.83 0 top
C2  72.01,20.83 0 top
C3  68.39,28.19 270 top
C4  57.28,15.24 180 top
C5  57.28,25.4 180 top
C6  35.56,39.5 180 top
C7  35.56,37.34 180 top
C8  41.53,38.35 0 top
C9  41.53,35.81 0 top
C12  29.21,53.09 90 top
C13  27.56,53.09 90 top
C36  65.15,36.83 270 top
C37  61.09,36.83 270 top
C43  68.71,36.83 270 top
D1  53.21,25.91 270 top
D2  68.45,23.62 90 top
D3  41.91,45.97 180 top
D4  54.23,36.58 0 top
D5  45.85,42.55 0 top
D7  75.56,36.83 0 top
F1  62.87,39.12 0 top
F3  65.91,43.43 0 top
IC1  39.23,54.27 180 top
J1  39.99,69.64 180 top
J2  65.91,52.65 270 top
L1  74.04,26.16 270 top
LSP25  31.37,32 0 top
R1  68.45,20.83 180 top
R2  52.96,15.24 0 top
R3  40.25,50.97 0 top
R4  37.2,50.97 0 top
R5  34.15,50.97 0 top
R6  33.64,53.51 270 top
R7  36.18,57.45 180 top
R8  33.64,56.56 270 top
R9  44.19,52.88 270 top
R10  46.34,51.1 270 top
R11  57.53,36.58 90 top
R12  46.61,21.84 180 top
R13  46.61,19.3 180 top
R14  46.61,16.76 180 top
R15  46.61,14.22 180 top
R16  22.48,14.22 0 top
R17  22.48,16.76 0 top
R18  22.48,19.3 0 top
R19  22.48,21.84 0 top
R20  30.73,34.29 0 top
R30  28.07,56.39 180 top
R31  18.92,47.37 270 top
R32  18.92,44.83 90 top
R33  25.02,44.83 270 top
R34  23.5,44.83 270 top
R35  21.97,44.83 270 top
R36  20.45,44.83 270 top
R37  17.4,44.83 270 top
R38  15.88,44.83 270 top
SJ2  75.31,25.65 270 bottom
SJ_A3  25.78,34.29 180 top
SJ_A4  25.78,38.61 180 top
SJ_A5  19.43,34.29 180 top
SJ_A6  19.43,38.61 180 top
SJ_A7  13.72,44.83 90 top
SJ_A8  13.72,48.51 270 top
SV1  28.83,65.02 90 top
SV2  35.18,5.08 180 top
SV3  35.18,10.16 180 top
SV4  3.3,54.74 90 top
SV5  8.38,54.74 90 top
TP1  75.31,34.04 0 top
TP2  62.61,34.04 0 top
TP3  65.91,14.92 180 top
TP4  71.75,31.37 180 top
TP5  65.66,23.18 180 top
TP6  53.72,13.72 90 top
TP7  60.58,14.99 90 top
TP8  49.15,22.86 90 top
TP9  60.58,26.92 90 top
TP10  60.58,19.81 90 top
TP11  27.05,33.02 180 top
TP12  20.19,33.02 180 top
TP13  46.86,57.28 270 top
TP14  15.11,44.07 270 top
TP15  19.43,68.58 90 top
TP16  22.23,57.66 270 top
TP17  21.59,58.55 270 top
TP18  19.69,46.61 270 top
TP28  26.29,56.39 270 top
TP29  14.99,49.28 180 top
TP30  30.35,54.1 0 top
TP35  79.76,52.96 0 top
TP36  51.94,38.86 0 top
U1  72.77,16.76 180 top
U2  54.99,20.83 180 top
U4  23.24,53.09 0 top
U$1  ADC128D818  [TSSOP16']  36.45,32 270 top
U$2  [CORNER]  5.46,67.56 270 top
U$3  [CORNER]  76.33,5.33 90 top
U$4  [CORNER]  76.33,67.56 180 top
U$5  [CORNER]  5.46,5.33 0 top

### Tracks (layer width: path | path; a pad name or v marks a point on that pad's centre or on a via)
24V_EMI
  Top 1.27: U1.1 75.38,16.83 C1.1 75.38,22.53 arc90 L1.2
  Bottom 1.27: SJ2.2 75.06,17.02 U1.1
24V_IN  (via drill 0.35)
  other vias: 62.1,51.05 62.1,49.78 60.83,51.05 60.83,49.78 59.56,51.05 59.56,49.78 58.29,51.05 57.02,51.05 57.02,49.78 58.29,49.78 55.75,49.78 55.75,51.05
  pour Bottom (isolate 0.406): 62.1,40.89 54.48,40.89 54.48,54.86 68.45,54.86 68.45,47.24 62.1,47.24
  pour Top (isolate 0.406): 54.48,40.89 62.1,40.89 62.1,47.24 68.45,47.24 68.45,54.86 54.48,54.86
!LDAC!
  Top 0.305: R32.2 R31.2 19.67,46.59 TP18.1 19.89,46.81 19.89,47.41 20.97,48.49 U4.1
+3V3  (via drill 0.35)
  Top 0.305: IC1.1 42.14,53.27 43.38,52.02 | R9.2 43.38,52.02 | C5.1 58.04,25.59 58.04,26.92 | C13.1 27.66,52.24 | 27.66,52.24 C12.1 30.19,52.24 v30.99,51.44 | SJ_A7.1 TP14.1 15.13,44.05 R38.2 R37.2 R32.1 R36.2 R35.2 R34.2 R33.2 25.74,44.77 arc45 26.04,45.49 26.04,48.51 arc45 25.78,49.14 25.52,49.4 U4.8 25.52,51.46 25.93,51.88 | U4.3 22.27,51.22 22.63,51.58 arc-45 23.34,51.88 25.93,51.88 | 26.29,52.24 27.66,52.24 | 43.38,52.02 42.94,51.58 42.94,49.77 42.11,48.94 arc-45 41.4,48.64 v36.2,48.64 | 25.93,51.88 26.29,52.24 | v44.45,48.26 46.35,50.16 R10.2 | SV1.3 28.92,66.29 arc-45 29.63,66 30.72,64.91 arc-45 31.01,64.2 31.01,58.87 arc-45 30.72,58.15 28.96,56.39 R30.1 28.25,55.8 arc-45 27.54,55.5 27.34,55.5 arc45 26.63,55.2 26.59,55.16 arc45 26.29,54.44 26.29,52.24
  Top 0.508: C5.1 58.23,28.01 52.96,33.27 50.42,33.27 47.88,35.81 v47.88,40.89 | 42.94,49.77 v44.45,48.26
  Top 0.559: TP6.1 53.72,15.22 R2.2 53.74,16.4 54.99,17.65 54.99,21.84 56.28,23.13 U2.3
  Top 1.016: TP6.1 53.72,10.41 49.66,6.35 SV2.1 SV2.3 SV2.5 SV2.7 SV2.9 SV2.11 SV2.13 SV2.15 24.77,6.35 4.57,26.54 SV4.1 SV4.3 SV4.5 SV4.7 SV4.9 SV4.11
  Bottom 0.305: v30.99,51.44 33.15,49.28 34.83,49.28 34.85,49.3 35.5,49.3 36.16,48.64 v36.2,48.64
  Bottom 0.508: v47.88,40.89 47.88,44.83 v44.45,48.26
  pour Top (isolate 0.305): 61.34,28.19 57.53,28.19 57.53,22.61 61.34,22.61
+5V  (via drill 0.35)  (1 unrouted)
  Top 0.305: U2.1 59.05,17.66 v59.05,17.27 | U$1.V+ 36.12,35.54 34.71,36.96 C7.2 C6.2 34.71,42.09 arc45 34.41,42.8 33.6,43.62 arc-45 33.3,44.33 R5.1 33.3,51.84 33.65,52.19 R6.2 33.68,52.62 34.66,52.62 35.01,52.98 arc-45 35.73,53.27 IC1.10 | 39.74,30.48 45.59,24.63 arc45 46.18,24.38 v47.88,24.38 47.5,24 47.5,21.88 R12.1 R13.1 R14.1 R15.1 | TP11.1 26.54,33.53 SJ_A3.1 | SJ_A5.1 TP12.1 TP11.1 | 39.74,30.48 30.1,30.48 | 30.1,30.48 29.59,30.48 | 29.59,30.48 TP11.1 | R16.1 R17.1 R18.1 R19.1 21.63,23.11 28.99,30.48 29.59,30.48 | R20.1 29.76,34.16 29.76,30.82 30.1,30.48 | 36.12,34.51 arc45 36.42,33.79 39.74,30.48
  Top 0.559: TP7.1 61.09,15.49
  Top 1.016: 55.69,3.87 55.63,3.81 SV2.2 SV2.4 SV2.6 SV2.8 SV2.10 SV2.12 SV2.14 SV2.16 23.6,3.81 2.03,25.37 SV4.2 SV4.4 SV4.6 SV4.8 SV4.10 SV4.12
  Top 1.524: 55.69,3.87 60.58,8.76 TP7.1
  Bottom 0.305: v47.88,24.38 47.88,24.37 54.98,17.27 v59.05,17.27
  pour Top (isolate 0.305): 65.15,7.87 65.15,21.84 71.5,21.84 71.5,7.87
  pour Top (isolate 0.406): 66.42,21.84 65.15,21.84 65.15,16.76 66.42,16.76
  pour Top (isolate 0.305): 61.34,12.95 61.34,18.8 57.53,18.8 57.53,12.95
  pour Top (isolate 0.406): 65.15,18.03 60.07,18.03 60.07,12.95 65.15,12.95
+24V  (via drill 0.35)
  Top 0.305: TP1.1 75.31,33.53 | 51.5,39.43 51.94,38.99 TP36.1 | TP13.1 46.74,57.4 46.61,57.4
  Top 0.508: v50.42,41.4 50.42,40.64 51.5,39.56 51.5,39.43 | v44.96,59.05 46.61,57.4 50.42,53.59 v50.42,43.69
  Bottom 0.508: v44.96,59.05 44.53,59.49 39.35,59.49 J1.24V(6) | v50.42,43.69 v50.42,41.4
  Bottom 1.27: SJ2.1 75.06,27.94 76.58,29.46 v79.12,29.46
  pour Top (isolate 0.406): 76.07,32 76.07,51.05 70.99,51.05 70.99,32
  pour Top (isolate 0.406): 71.5,39.62 71.5,36.83 51.18,36.83 51.18,39.62
  pour Top (isolate 0.406): 65.15,28.19 65.15,32 80.39,32 80.39,28.19
A0
  Top 0.305: U$1.A0 34.82,35.43 33.47,36.79 arc45 32.75,37.08 25.02,37.08
  Top 0.508: SJ_A3.2 25.02,37.08 SJ_A4.2
A1  (via drill 0.35)
  Top 0.305: U$1.A1 34.17,35.26 33.59,35.85 arc45 32.87,36.14 26.21,36.14 v26.16,36.2 | v24,36.2 18.67,36.2
  Top 0.406: SJ_A5.2 18.67,36.2 SJ_A6.2
  Bottom 0.305: v26.16,36.2 v24,36.2
ADDR0
  Top 0.305: 13.72,46.74 SJ_A7.2 | 13.72,46.74 SJ_A8.2 | 13.72,46.74 14.31,46.74 arc45 15.03,47.03 19.48,51.49 arc-45 19.94,51.68 21.1,51.68 arc-45 21.62,50.44 U4.2
DAC_!CLR!
  Top 0.305: R30.2 TP28.1 25.89,56.39 U4.9
DIM1  (via drill 0.35)
  Top 0.305: U4.7 24.87,48.67 v25.02,48.51 R33.1
  Bottom 0.305: v25.02,48.51 25.02,48.64 20.98,52.68 18.87,52.68 10.46,61.09 SV5.11
DIM2  (via drill 0.35)
  Top 0.305: U4.6 24.22,47.71 v23.75,47.24 23.5,46.99 R34.1
  Bottom 0.305: v23.75,47.24 23.75,47.91 24.03,48.19 24.03,48.84 20.74,52.12 18.51,52.12 12.09,58.55 SV5.9
DIM3  (via drill 0.35)
  Top 0.305: U4.5 23.57,48.84 v23.24,48.51 21.97,47.24 R35.1
  Bottom 0.305: v23.24,48.51 20.32,51.44 18.16,51.44 13.58,56.01 SV5.7
DIM4  (via drill 0.35)
  Top 0.305: U4.4 22.92,49.33 v20.83,47.24 20.45,46.86 R36.1
  Bottom 0.305: v20.83,47.24 17.8,50.27 17.8,50.74 15.08,53.47 SV5.5
DIM5  (via drill 0.35)
  Top 0.305: v17.02,47.62 17.02,45.99 R37.1 | U4.10 24.87,54.43 arc-45 24.49,53.52 arc-45 22.82,52.83 19.85,52.83 arc45 19.13,52.53 v17.02,50.42
  Bottom 0.305: v17.02,47.62 v17.02,50.42 16.51,50.93 SV5.3
DIM6  (via drill 0.35)
  Top 0.305: R38.1 15.88,46.1 16.13,46.36 v16.13,46.86 | v16.13,49.53 16.13,50.51 arc-45 16.43,51.23 18.5,53.3 arc-45 19.22,53.59 22.64,53.59 arc45 23.84,54.09 arc45 24.22,54.99 U4.11
  Bottom 0.305: v16.13,49.53 v16.13,46.86 16.13,48.39 SV5.1
DSCLM1  (1 unrouted)
  Top 0.305: R8.1 33.68,57.45 R7.2 35.34,56.23 36.3,55.27 IC1.6 | IC1.6 36.33,55.27 | 35.42,57.45 35.42,58.59 36.82,59.99 36.82,61.26 38.85,63.29 J1.DSCLM(5) | IC1.6 36.75,55.27
DSCLP1  (1 unrouted)
  Top 0.305: R8.2 R6.1 34.19,54.78 34.66,54.78 34.8,54.77 IC1.7 37.95,54.77 | J1.DSCLP(4) 38.47,58.59 38.47,56.13 38.47,55.71 38.47,55.29 38.02,54.83
DSDAM1  (via drill 0.35)
  Top 0.305: J1.DSDAM(2) 43.17,60.37 39.74,56.69 39.74,56.43 | IC1.9 37.04,53.76 38.91,53.76 39.66,54.52 39.66,56.33 39.74,56.41 39.74,56.43 | R4.2 R3.1 39.24,51.13 v39.24,52.07 | v41.01,56.43 39.74,56.43
  Bottom 0.305: v41.01,56.43 41.01,55.8 39.23,54.02 v39.23,52.08 v39.24,52.07
DSDAP1  (via drill 0.35)
  Top 0.305: R5.2 R4.1 36.35,52.28 v36.44,52.37 | J1.DSDAP(1) 43.3,62.15 42.66,62.15 41.9,61.38 41.9,60.11 v39.36,57.57 39.11,57.32 39.11,55.11 38.27,54.27 IC1.8
  Bottom 0.305: v36.44,52.37 36.44,53.64 38.47,55.67 38.47,56.69 v39.36,57.57
GND  (via drill 0.35)
  Top 0.305: C6.1 C7.1 36.41,36.23 36.77,35.87 U$1.GND 36.77,34.33 37.21,33.9 40.46,33.9 C9.2 | v41.77,52.37 41.1,51.69 | 41.1,51.69 R3.2 | 41.1,51.69 40.26,52.53 40.26,53.59 | 40.26,53.59 40.26,55.12 40.41,55.27 IC1.5 41.94,55.27 42.8,56.13 | D3.2 41.53,47.45 v41.53,47.75 | v20.19,40.26 SJ_A6.1 | SJ_A4.1 v26.54,40.26 | v36.95,56.18 36.95,57.36 | 36.95,57.36 R7.1 | 36.95,57.36 36.95,58.21 v37.45,58.72 38.33,59.59 38.57,59.59 39.47,60.49 39.47,61.23 41.53,63.29 J1.GND(3) | 36.41,40.89 v36.45,40.89 | TP29.1 15.34,49.63 | TP30.1 30.19,53.94 C12.2 27.66,53.94 C13.2 | v19.56,50.16 18.92,49.53 R31.1 | 40.26,53.59 39.56,52.9 38.91,52.9 38.33,52.32 v37.85,52.32 | U4.14 22.27,56.71 24.23,58.67 v25.02,58.67 | 42.8,55.88 42.8,56.13 | 42.8,56.13 v42.8,57.4
  Top 0.508: C9.2 43.43,35.81 | 43.43,35.81 45.34,35.81 50.42,30.73 | C8.2 43.51,38.35 | 43.51,38.35 43.43,38.27 43.43,35.81 | 43.51,38.35 D5.2 51.31,42.55 v51.69,42.16 | D3.2 36.41,42.33 36.41,40.89 C6.1
  Top 0.559: D4.C 54.29,37.39 v55.25,37.39
  Bottom 0.305: v41.77,52.37 41.53,52.12 v41.53,47.75 | v36.45,40.89 35.81,40.26 v26.54,40.26
  other vias: 55.75,62.48 55.75,61.21 55.75,59.94 55.75,58.67 55.75,57.4 55.75,56.13 54.48,56.13 54.48,57.4 54.48,58.67 54.48,59.94 54.48,61.21 54.48,62.48 76.07,62.48 76.07,61.21 76.07,59.94 76.07,58.67 76.07,57.4 76.07,56.13 77.34,56.13 77.34,57.4 77.34,58.67 77.34,59.94 77.34,61.21 77.34,62.48 63.12,35.1 51.94,35.36 69.47,25.15 78.61,22.35 73.53,15.24 73.53,14.48 74.3,14.48 74.3,15.24 73.53,13.72 74.3,13.72 67.18,25.15 51.69,18.29 52.45,18.29 51.69,17.53 52.45,17.53 50.93,18.29 50.93,17.53 52.45,23.11 52.45,23.88 51.69,23.11 50.93,23.11 51.69,23.88 50.93,23.88 56.26,20.32 54.99,26.42 56.26,21.34 54.99,14.48 59.56,19.81 55.63,9.53 63.12,20.57 29.97,38.73 49.15,57.4 48.9,45.59 29.46,13.46 35.31,18.03 37.85,14.35 42.8,30.73 49.4,36.45 57.79,31.24 51.69,61.21 51.69,49.78 34.8,48.13 46.61,38.35 19.94,26.92 22.35,12.57 26.04,13.46 32.64,13.46 19.81,56.26 28.83,45.97 31.24,49.4 30.99,53.21 15.62,59.44 9.14,26.92 48.77,9.65 6.86,38.35 8.64,46.1 10.8,46.36 8.64,62.99 18.29,58.55 53.72,8.13 29.97,59.18 32.26,59.05 40.26,14.35
  pour Top (isolate 0.305, rank 2): 2.41,30.73 2.41,72.64 85.47,72.64 85.47,30.73
  pour Bottom (isolate 0.406, rank 2): 2.29,72.64 85.47,72.64 85.47,30.73 2.29,30.73
  pour Top (isolate 0.305, rank 2): 64.14,2.79 64.14,32 85.73,32 85.73,2.79
  pour Bottom (isolate 0.406, rank 2): 85.6,7.11 85.6,32 64.26,32 64.26,7.11
  pour Top (isolate 0.406, rank 3): 2.29,7.24 65.41,7.24 65.41,30.73 2.29,30.73
  pour Bottom (isolate 0.406): 2.41,7.11 2.41,32.26 64.52,32.26 64.52,7.11
IN0  (via drill 0.35)
  Top 0.305: R12.2 v44.07,21.84 38.99,26.92 arc-45 38.72,27.56 U$1.IN0
  Bottom 0.305: v44.07,21.84 42.96,21.84 36.53,15.41 36.58,15.37 36.58,11.56 SV3.7
IN1  (via drill 0.35)
  Top 0.305: R13.2 v44.07,19.3 38.37,25 arc-45 38.07,25.72 U$1.IN1
  Bottom 0.305: v44.07,19.3 42.96,19.3 38.99,15.33 SV3.5
IN2  (via drill 0.35)
  Top 0.305: R14.2 v44.07,16.76 37.72,23.11 arc-45 37.42,23.83 U$1.IN2
  Bottom 0.305: v44.07,16.76 42.96,16.76 41.53,15.33 SV3.3
IN3  (via drill 0.35)
  Top 0.305: R15.2 v44.07,14.22 37,21.29 arc-45 36.77,21.84 U$1.IN3
  Bottom 0.305: SV3.1 v44.07,14.22
IN4  (via drill 0.35)
  Top 0.305: R16.2 v25.02,14.22 35.83,25.03 arc45 36.12,25.75 U$1.IN4
  Bottom 0.305: v25.02,14.22 25.02,12.95 26.29,11.68 SV3.15
IN5  (via drill 0.35)
  Top 0.305: R17.2 v25.02,16.76 25.11,16.76 arc45 25.83,17.06 35.18,26.41 arc45 35.47,27.13 U$1.IN5
  Bottom 0.305: v25.02,16.76 25.49,16.76 28.34,13.91 28.34,11.91 SV3.13
IN6  (via drill 0.35)
  Top 0.305: R18.2 v25.02,19.3 25.87,19.3 arc45 26.59,19.6 34.53,27.54 arc45 34.82,28.26 U$1.IN6
  Bottom 0.305: v25.02,19.3 26.13,19.3 31.37,14.06 SV3.11
IN7  (via drill 0.35)
  Top 0.305: R19.2 v25.02,21.84 26.47,21.84 arc45 27.19,22.14 U$1.IN7
  Bottom 0.305: v25.02,21.84 26.13,21.84 32.56,15.41 32.64,15.33 33.91,14.06 SV3.9
INTB
  Top 0.305: U$1.INTB 35.47,33.87 35.18,33.58 32.3,33.58 R20.2 31.58,32.35 31.37,32.13 LSP25.MP
N$1
  Top 0.305: D1.A 54.25,24.12 54.25,18.13 52.18,16.06 R2.1
N$2
  Top 0.559: R1.1 69.23,23.59 D2.A
N$4
  Top 0.559: D4.A 54.26,35.8 R11.1
SCL  (via drill 0.35)
  Top 0.305: U$1.SCL 37.42,39.2 arc-45 37.72,39.92 41.11,43.31 v41.15,43.31 41.15,43.36 D3.1 47.23,49.43 arc45 47.37,49.78 47.37,51.05 arc45 47.19,51.49 46.73,51.95 R10.1 46.35,53.1 arc45 46.05,53.82 45.39,54.48 arc45 44.67,54.77 IC1.4 | v20.95,57.66 20.95,56.02 U4.16 | TP17.1 21.59,58.29 v20.95,57.66 | SV1.2 27.47,63.75 arc45 26.75,63.46 v20.95,57.66
  Bottom 0.305: v20.95,57.66 35.01,43.61 arc45 35.73,43.31 v41.15,43.31
SDA  (via drill 0.35)
  Top 0.305: U$1.SDA 38.07,37.08 arc-45 38.33,37.69 v42.29,41.66 43.18,42.55 D5.1 43.99,43.18 48.08,47.27 arc45 48.38,47.99 48.38,51.57 arc45 48.08,52.28 v47.23,53.13 | SV1.1 26.23,61.21 arc45 25.51,60.92 22.25,57.66 TP16.1 21.91,57.35 arc45 21.62,56.63 U4.15 21.62,55.57 arc-45 21.32,54.85 21.25,54.78 arc-45 20.53,54.48 v19.69,54.48 | v45.46,53.13 45.16,53.43 arc45 44.44,53.73 R9.1 44.14,53.77 IC1.2
  Bottom 0.305: v47.23,53.13 v45.46,53.13 | v42.29,41.66 42.16,41.78 35.35,41.78 arc-45 34.63,42.08 22.52,54.19 arc45 21.8,54.48 v19.69,54.48
VREF
  Top 0.305: U$1.VREF 38.72,35.55 40.68,37.5 | 40.68,37.5 C8.1 | 40.68,37.5 C9.1

### Text on the board
tPlace: GPIO | GND | EDGE | Board | +3V3 | SCL | Open Ag | 1 | SDA | 2 | SCL | SDA | +24V | 3 | 4 | GND | DAC / ADDR | GND | +5V | +3V3 | Ground | Analog Out | +3V3 | GND | GND | 24V | GND | 24V | OUT | ADC A1 Adress | +5V | ADC A0 Adress | +5V | Barrel Jack Connector w/24V Conditioning + Fuse + LED | 24V | 5-to-3V3@400mA Lin Reg | A1 | A0 | Address | L | L | 1Dh | L | M | 1Eh | 3.3V | L | H | 1Fh | GND | M | L | 2Dh | M | M | 2Eh | GND | M | H | 2Fh | GND | H | L | 35h | H | M | 36h | GND | H | H | 37h | 5V | 3.3V | GND | 5V | 4 | 5 | 6 | 7 | 0 | 1 | 2 | 3 | IN | Analog In | Ground | +3V3 | +5V
bPlace: INT